# EAGLE schematic boosst_new (EAGLE 7.5.0)
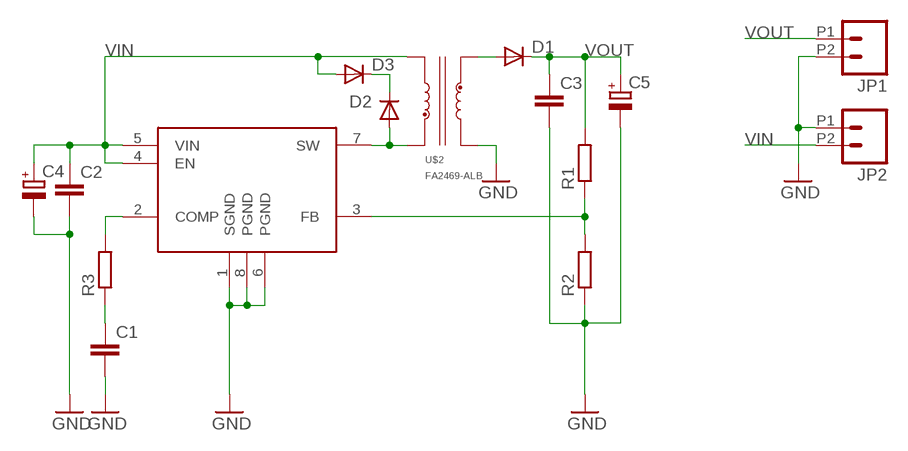
[diagram p0: schematic, sheet 1]

## Parts
C1  C-EUC0805  [C0805]
C2  C-EUC1210  [C1210]
C3  C-EUC1210  [C1210]
C4  CPOL-EUE2.5-5  [E2,5-5]
C5  CPOL-EUE2.5-5  [E2,5-5]
D1  DIODE-DO-214AC  [DO-214AC]
D2  DIODE-SOD-123  [SOD-123]
D3  DIODE-SOD-123  [SOD-123]
JP1  M022.54MM_SCREWTERM  [1X02_2.54_SCREWTERM]
JP2  M022.54MM_SCREWTERM  [1X02_2.54_SCREWTERM]
R1  R-EU_R0805  [R0805]
R2  R-EU_R0805  [R0805]
R3  R-EU_R0805  [R0805]
U$1  MC3172YM  [SOIC8]
U$2  FA2469-ALB  [FA2469]

## Nets
GND: C1.2 C2.2 C3.2 C4.- C5.- JP1.P2 JP2.P1 R2.1 U$1.1(SGND) U$1.6(PGND) U$1.8(PGND) U$2.6
N$2: D2.C D3.C
N$3: D1.2(A) U$2.4
N$4: R3.2 U$1.2(COMP)
N$5: R1.1 R2.2 U$1.3(FB)
N$8: C1.1 R3.1
SW: D2.A U$1.7(SW) U$2.1
VIN: C2.1 C4.+ D3.A JP2.P2 U$1.4(EN) U$1.5(VIN) U$2.3
VOUT: C3.1 C5.+ D1.1(C) JP1.P1 R1.2

## Library data of the parts
C1-C3 = rcl:C-EU: CAPACITOR, European symbol
C4 C5 = rcl:CPOL-EU: POLARIZED CAPACITOR, European symbol
D1-D3 = dp_devices:DIODE: Various Diode Packages
JP1 JP2 = SparkFun-Connectors:M02: Standard 2-pin 0.1" header. Use with - straight break away headers ( PRT-00116) - right angle break away headers (PRT-00553) - swiss pins (PRT-00743) - machine pins (PRT-00117) - female headers (PRT-00115) Molex polarized connector foot print use with: PRT-08233 with associated crimp pins and housings. 2.54_SCREWTERM for use with PRT-10571. 3.5mm Screw Terminal footprints for PRT-08084 5mm Screw Terminal footprints for use with PRT-08432
R1-R3 = rcl:R-EU_: RESISTOR, European symbol
U$1 = custom_lbr:MC3172YM
U$2 = custom_lbr:FA2469-ALB